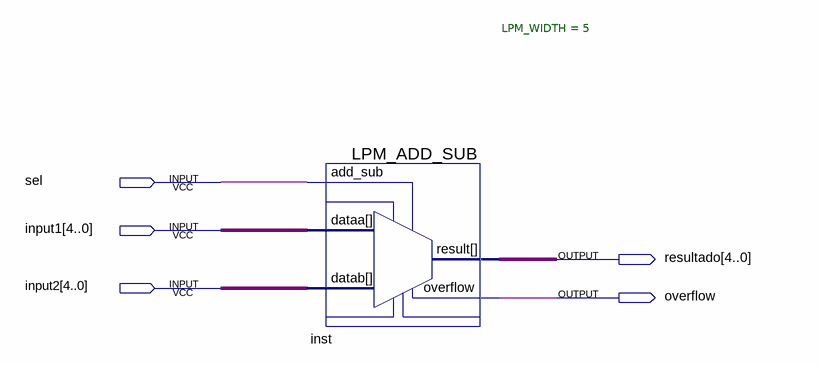
[diagram p0: schematic sheet]
// Quartus schematic arithm4bits.bdf as structural Verilog: 1 symbols, 5 pins
module arithm4bits (
  input  sel,
  input  [4:0] input1,
  input  [4:0] input2,
  output [4:0] resultado,
  output overflow
);

  LPM_ADD_SUB #(.LPM_WIDTH(5)) inst (
    .add_sub(sel), .dataa(input1), .datab(input2), .overflow(overflow), .result(resultado));
endmodule
